# Altium schematic sheet nufsr-motion-sensor.schdoc: NUSense
size A4; Organization: Elby Designs; Address1: 9 Follan Close; Address2: Kariong; Address3: NSW 2250; Address4: Australia; Revision: 1; SheetNumber: 3; SheetTotal: 15; DrawnBy: Motion Tracking Sensor; Engineer: Laurie Biddulph; PageSetup: Record=PageOptions|CenterHorizontal=True|CenterVertical=True|PrintScale=1.38|XCorrection=1.00|YCorrection=1.00|PrintKind=1|BorderSize=5000000|LeftOffset=0|BottomOffset=0|Orientation=2|PaperLength=1000|PaperWidth=1000|Scale=100|PaperSource=7|PrintQuality=-4|MediaType=1|DitherType=10|PaperKind=A3|PrintScaleMode=1
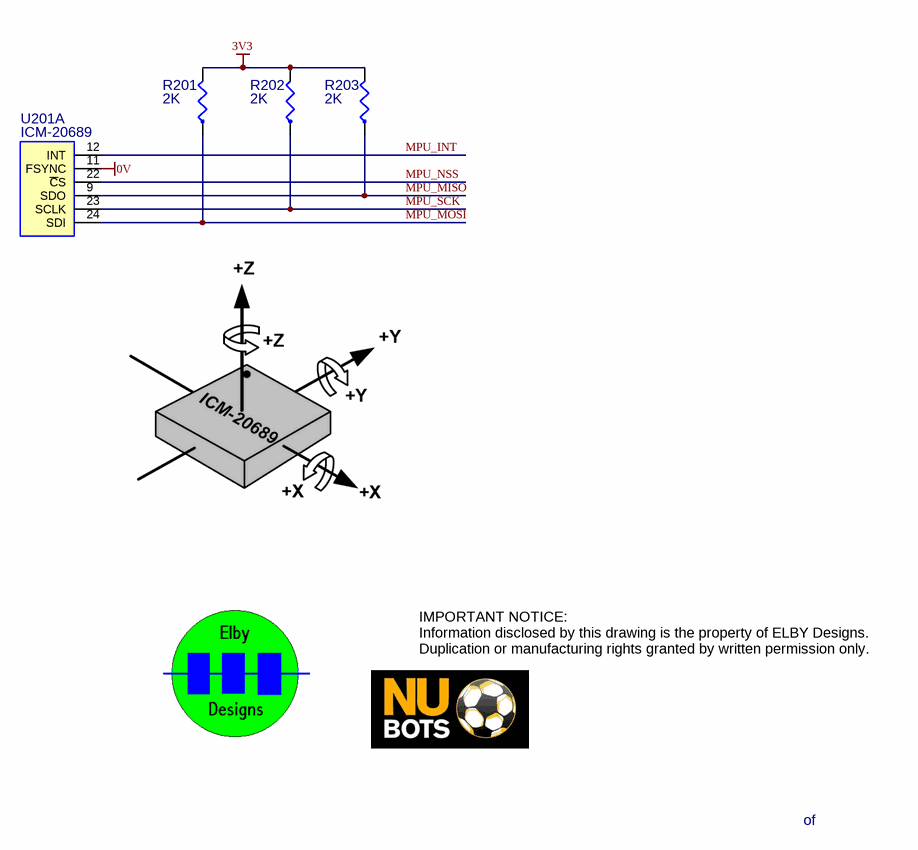
[diagram p0: nufsr-motion-sensor.schdoc]

## Parts
R201  2K  [0603(LB)]
R202  2K  [0603(LB)]
R203  2K  [0603(LB)]
U201  ICM-20689  [QFN-24]  (part A of 3)

## Nets
0V: U201.11(FSYNC)
3V3: R201.2 R202.2 R203.2
MPU_INT: U201.12(INT)
MPU_MISO: R203.1 U201.9(SDO)
MPU_MOSI: R201.1 U201.24(SDI)
MPU_NSS: U201.22(~{C}S)
MPU_SCK: R202.1 U201.23(SCLK)

## Notes on the sheet
- IMPORTANT NOTICE:
  Information disclosed by this drawing is the property of ELBY Designs.
  Duplication or manufacturing rights granted by written permission only.
- of

## Library data of the parts
R201-R203 = RM-2K(LB): 0.5W 1% Metal Film Resistor; EMRP: RM-2K
U201 = ICM-20869: Motion Tracking